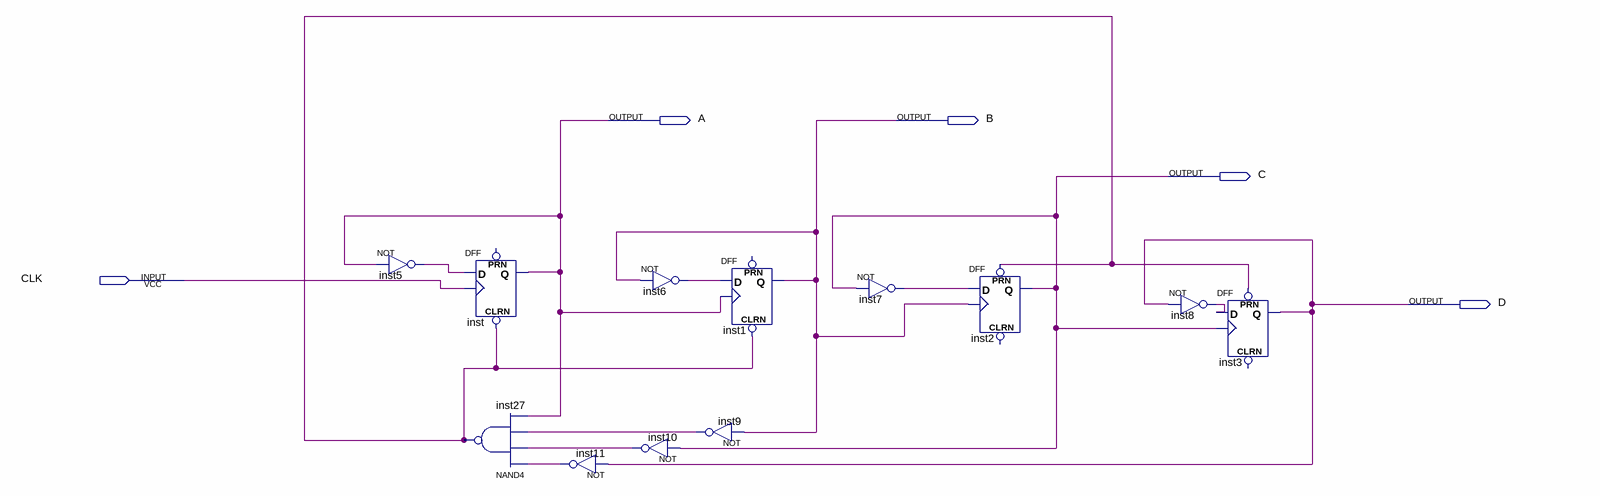
[diagram p0: schematic sheet]
// Quartus schematic ripple_DOWN_counter.bdf as structural Verilog: 12 symbols, 5 pins
module ripple_DOWN_counter (
  input  CLK,
  output A,
  output B,
  output C,
  output D
);

  wire inst5_out, inst6_out, inst7_out, inst8_out, inst9_out, inst10_out, inst11_out, inst27_out;

  not inst5 (inst5_out, A);
  DFF inst (.CLRN(inst27_out), .CLK(CLK), .D(inst5_out), .Q(A));  // open: PRN
  nand inst27 (inst27_out, inst11_out, inst10_out, inst9_out, A);
  not inst11 (inst11_out, D);
  not inst6 (inst6_out, B);
  not inst10 (inst10_out, C);
  DFF inst1 (.CLRN(inst27_out), .CLK(A), .D(inst6_out), .Q(B));  // open: PRN
  not inst9 (inst9_out, B);
  not inst7 (inst7_out, C);
  DFF inst2 (.CLK(B), .D(inst7_out), .PRN(inst27_out), .Q(C));  // open: CLRN
  not inst8 (inst8_out, D);
  DFF inst3 (.CLK(C), .D(inst8_out), .PRN(inst27_out), .Q(D));  // open: CLRN
endmodule
